# EAGLE schematic attiny85 (EAGLE 9.6.2)
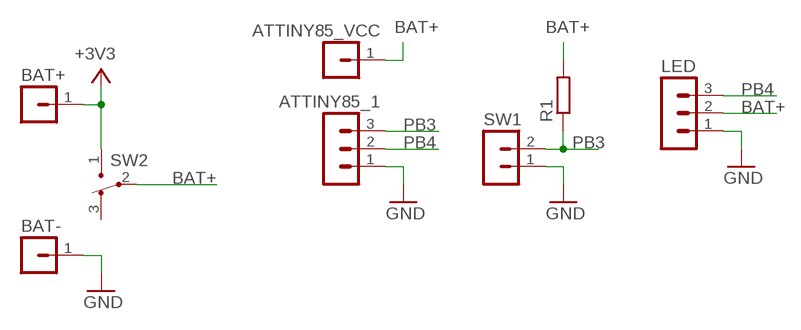
[diagram p0: schematic, sheet 1]

## Parts
ATTINY85_1  PINHEAD-MA03-1  [PINHEAD-MA03-1]
ATTINY85_VCC  PINHEAD-MA01-1  [PINHEAD-MA01-1]
BAT+  PINHEAD-MA01-1  [PINHEAD-MA01-1]
BAT-  PINHEAD-MA01-1  [PINHEAD-MA01-1]
LED  PINHEAD-MA03-1  [PINHEAD-MA03-1]
R1  R-EU_0204/5  [0204/5]
SW1  PINHEAD-MA02-1  [PINHEAD-MA02-1]
SW2  SW3-1  [SW3-1]

## Nets
+3V3: BAT+.1 SW2.1
BAT+: ATTINY85_VCC.1 LED.2 R1.2 SW2.2
GND: ATTINY85_1.1 BAT-.1 LED.1 SW1.1
PB3: ATTINY85_1.3 R1.1 SW1.2
PB4: ATTINY85_1.2 LED.3
Unconnected: SW2.3

## Library data of the parts
ATTINY85_1 LED = ytani1:PINHEAD-MA03-1: PIN HEADER; OC_FARNELL: unknown; OC_NEWARK: unknown
ATTINY85_VCC BAT+ BAT- = ytani1:PINHEAD-MA01-1
R1 = rcl:R-EU_: RESISTOR, European symbol; SPICEPREFIX: R
SW1 = ytani1:PINHEAD-MA02-1: PIN HEADER
SW2 = ytani1:SW3-1: Slide Switch 3x1 pin https://www.amazon.co.jp/gp/product/B01LYVYQNO/ SS12D00G3 2ポジションSPDT 1P2T 3ピン; MF: HiLetgo; URL_AMAZON: https://www.amazon.co.jp/gp/product/B01LYVYQNO/